# EAGLE design PDIP-Potentiostat-14 (EAGLE 6.4)
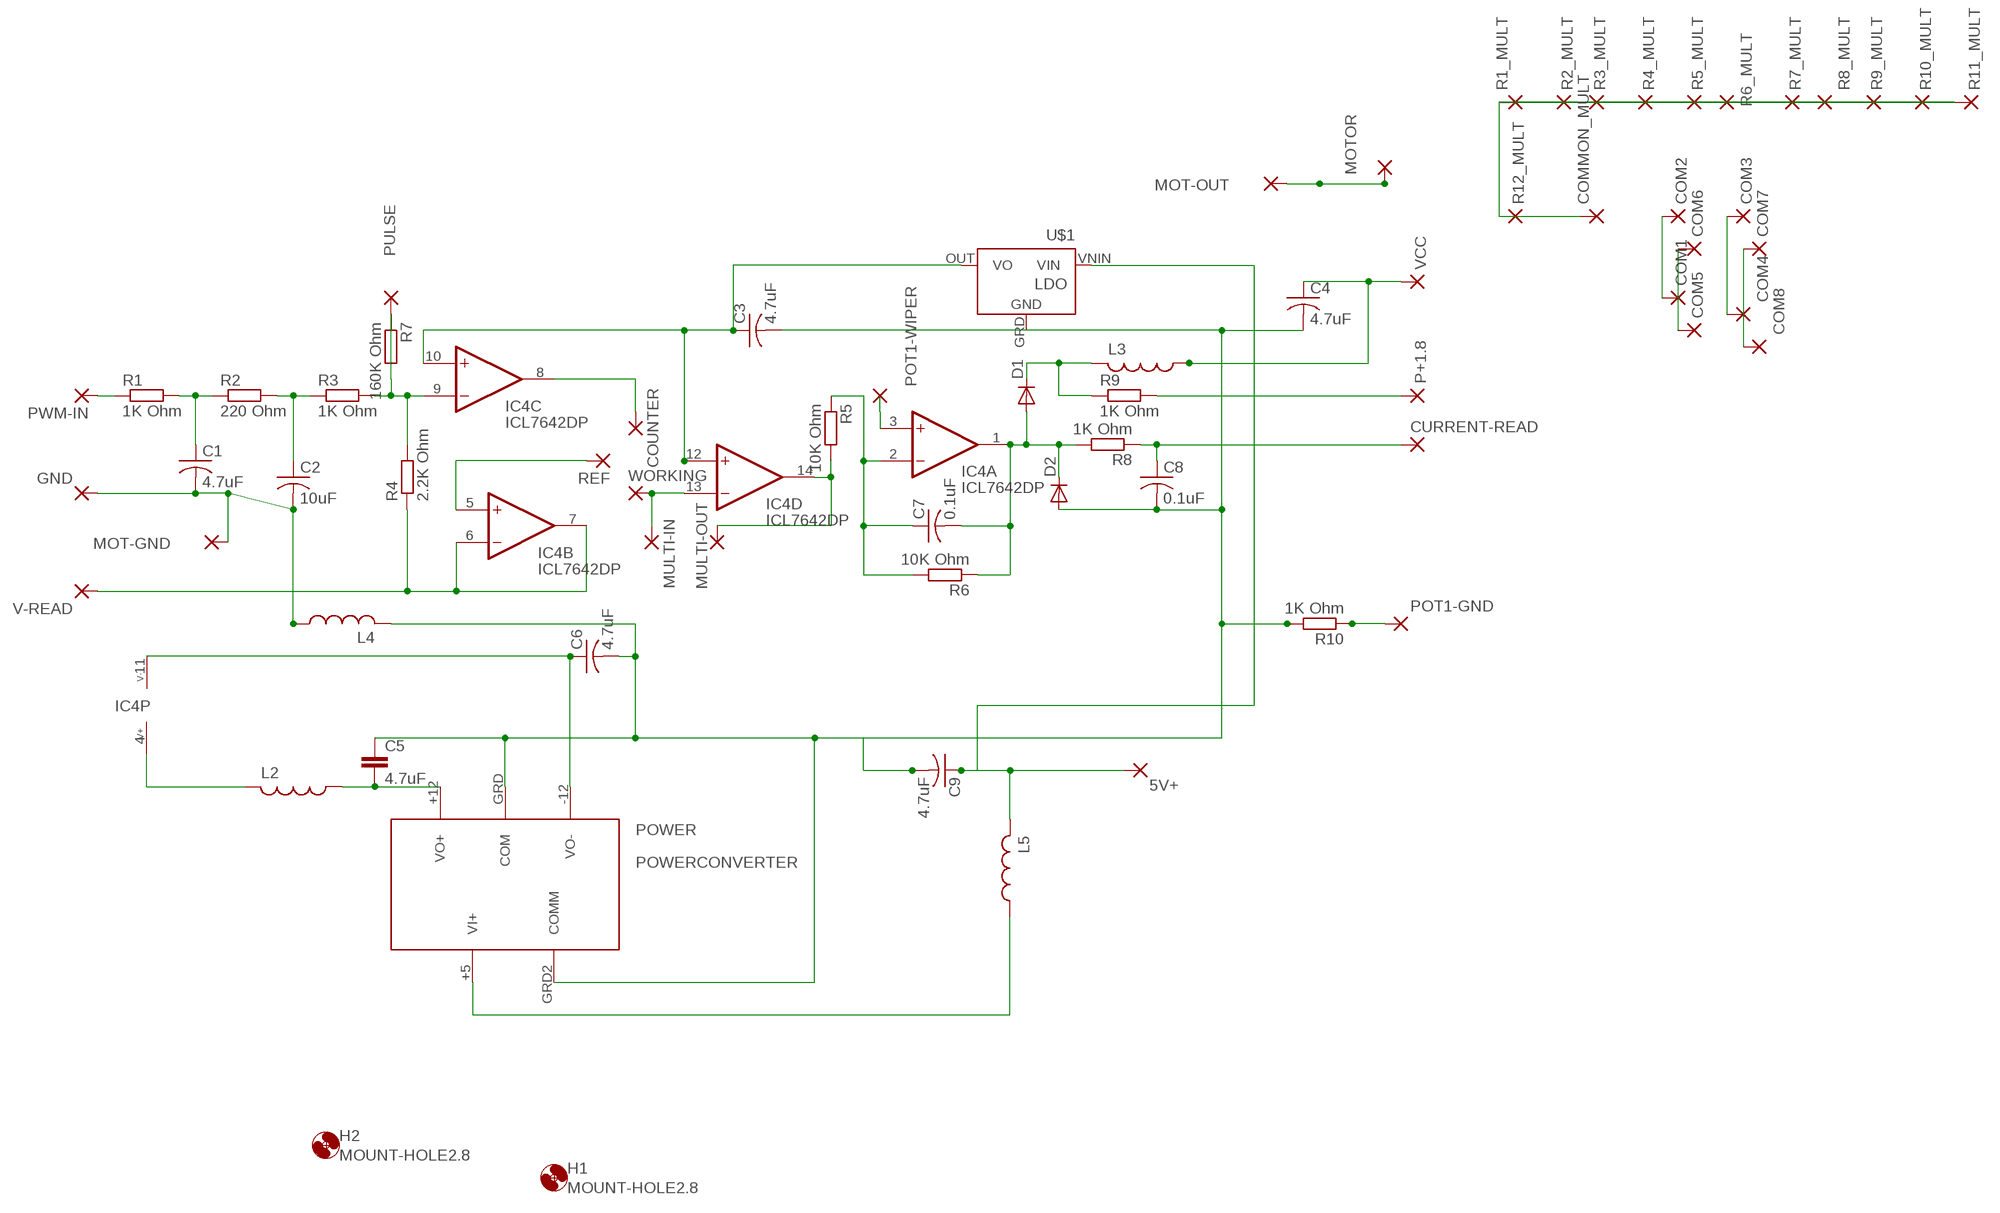
[diagram p0: schematic, sheet 1]

## Parts
5V+  1,6/0,9  [1,6/0,9]
C1  4.7uF  C-US025-050X050  [C025-050X050]
C2  10uF  C-US025-050X050  [C025-050X050]
C3  4.7uF  C-US025-050X050  [C025-050X050]
C4  4.7uF  C-US025-050X050  [C025-050X050]
C5  4.7uF  C-EU025-050X050  [C025-050X050]
C6  4.7uF  C-US025-050X050  [C025-050X050]
C7  0.1uF  C-US025-050X050  [C025-050X050]
C8  0.1uF  C-US025-050X050  [C025-050X050]
C9  4.7uF  C-US025-050X050  [C025-050X050]
COM1  1,6/0,9  [1,6/0,9]
COM2  1,6/0,9  [1,6/0,9]
COM3  1,6/0,9  [1,6/0,9]
COM4  1,6/0,9  [1,6/0,9]
COM5  1,6/0,9  [1,6/0,9]
COM6  1,6/0,9  [1,6/0,9]
COM7  1,6/0,9  [1,6/0,9]
COM8  1,6/0,9  [1,6/0,9]
COMMON_MULT  1,6/0,9  [1,6/0,9]
COUNTER  1,6/0,9  [1,6/0,9]
CURRENT-READ  1,6/0,9  [1,6/0,9]
D1  DIODE-D-7.5  [D-7.5]
D2  DIODE-D-7.5  [D-7.5]
GND  1,6/0,9  [1,6/0,9]
H1  MOUNT-HOLE2.8  [2,8]
H2  MOUNT-HOLE2.8  [2,8]
IC4  ICL7642DP  [DIL14]
L2  L-USTFI0305  [TFI0305]
L3  L-USTFI0305  [TFI0305]
L4  L-USTFI0305  [TFI0305]
L5  L-USTFI0305  [TFI0305]
MOT-GND  1,6/0,9  [1,6/0,9]
MOT-OUT  1,6/0,9  [1,6/0,9]
MOTOR  1,6/0,9  [1,6/0,9]
MULTI-IN  1,6/0,9  [1,6/0,9]
MULTI-OUT  1,6/0,9  [1,6/0,9]
P+1.8  1,6/0,9  [1,6/0,9]
POT1-GND  1,6/0,9  [1,6/0,9]
POT1-WIPER  1,6/0,9  [1,6/0,9]
POWER  POWERCONVERTER  [HMM2]
PULSE  1,6/0,9  [1,6/0,9]
PWM-IN  1,6/0,9  [1,6/0,9]
R1  1K Ohm  R-EU_0204/7  [0204/7]
R1_MULT  1,6/0,9  [1,6/0,9]
R2  220 Ohm  R-EU_0204/7  [0204/7]
R2_MULT  1,6/0,9  [1,6/0,9]
R3  1K Ohm  R-EU_0204/7  [0204/7]
R3_MULT  1,6/0,9  [1,6/0,9]
R4  2.2K Ohm  R-EU_0204/7  [0204/7]
R4_MULT  1,6/0,9  [1,6/0,9]
R5  10K Ohm  R-EU_0204/7  [0204/7]
R5_MULT  1,6/0,9  [1,6/0,9]
R6  10K Ohm  R-EU_0204/7  [0204/7]
R6_MULT  1,6/0,9  [1,6/0,9]
R7  160K Ohm  R-EU_0204/7  [0204/7]
R7_MULT  1,6/0,9  [1,6/0,9]
R8  1K Ohm  R-EU_0204/7  [0204/7]
R8_MULT  1,6/0,9  [1,6/0,9]
R9  1K Ohm  R-EU_0204/7  [0204/7]
R9_MULT  1,6/0,9  [1,6/0,9]
R10  1K Ohm  R-EU_0204/7  [0204/7]
R10_MULT  1,6/0,9  [1,6/0,9]
R11_MULT  1,6/0,9  [1,6/0,9]
R12_MULT  1,6/0,9  [1,6/0,9]
REF  1,6/0,9  [1,6/0,9]
U$1  LDO  [LDO]
V-READ  1,6/0,9  [1,6/0,9]
VCC  1,6/0,9  [1,6/0,9]
WORKING  1,6/0,9  [1,6/0,9]

## Nets
+5V: D1.C L3.2 R9.1
N$1: L5.1 POWER.+5(VI+)
N$2: IC4.6(B:-IN) IC4.7(B:OUT) R4.1 V-READ.1(P)
N$3: IC4.5(B:+IN) REF.1(P)
N$4: 5V+.1(P) C9.1 L5.2 U$1.VNIN(VIN)
N$5: COUNTER.1(P) IC4.8(C:OUT)
N$6: IC4.14(D:OUT) MULTI-OUT.1(P) R5.2
N$7: C7.1 IC4.2(A:-IN) R5.1 R6.2
N$8: IC4.4(P:V+) L2.2
N$9: PWM-IN.1(P) R1.1
N$10: IC4.9(C:-IN) R3.2 R4.2 R7.2
N$11: C3.2 C4.2 C5.1 C6.2 C8.2 C9.2 D2.A L4.2 POWER.GRD2(COMM) POWER.GRD(COM) R10.2 U$1.GRD(GND)
N$12: PULSE.1(P) R7.1
N$13: C1.1 R1.2 R2.1
N$14: IC4.3(A:+IN) POT1-WIPER.1(P)
N$15: C1.2 C2.2 GND.1(P) L4.1 MOT-GND.1(P)
N$16: C5.2 L2.1 POWER.+12(VO+)
N$17: IC4.13(D:-IN) MULTI-IN.1(P) WORKING.1(P)
N$18: P+1.8.1(P) R9.2
N$19: C2.1 R2.2 R3.1
N$20: C7.2 D1.A D2.C IC4.1(A:OUT) R6.1 R8.2
N$21: COM3.1(P) COM4.1(P)
N$22: C3.1 IC4.10(C:+IN) IC4.12(D:+IN) U$1.OUT(VO)
N$23: MOT-OUT.1(P) MOTOR.1(P)
N$24: C6.1 IC4.11(P:V-) POWER.-12(VO-)
N$25: C8.1 CURRENT-READ.1(P) R8.1
N$26: C4.1 L3.1 VCC.1(P)
N$27: POT1-GND.1(P) R10.1
N$29: COM1.1(P) COM2.1(P)
N$30: COM7.1(P) COM8.1(P)
N$31: COM5.1(P) COM6.1(P)
N$32: COMMON_MULT.1(P) R1_MULT.1(P) R2_MULT.1(P) R3_MULT.1(P) R4_MULT.1(P) R5_MULT.1(P) R6_MULT.1(P) R7_MULT.1(P) R8_MULT.1(P) R9_MULT.1(P) R10_MULT.1(P) R11_MULT.1(P) R12_MULT.1(P)

## Library data of the parts
5V+ COM1-COM8 COMMON_MULT COUNTER CURRENT-READ GND MOT-GND MOT-OUT MOTOR MULTI-IN MULTI-OUT P+1.8 POT1-GND POT1-WIPER PULSE PWM-IN R1_MULT R2_MULT R3_MULT R4_MULT R5_MULT R6_MULT R7_MULT R8_MULT R9_MULT R10_MULT R11_MULT R12_MULT REF V-READ VCC WORKING = wirepad:1,6/0,9: THROUGH-HOLE PAD
C1-C4 C6-C9 = rcl:C-US: CAPACITOR, American symbol
C5 = resistor:C-EU: CAPACITOR, European symbol
D1 D2 = diode:DIODE-: DIODE
H1 H2 = holes:MOUNT-HOLE: MOUNTING HOLE with drill center marker
IC4 = maxim:ICL764*: Quad Operational Amplifiers Source: http://datasheets.maxim-ic.com/en/ds/ICL7612-ICL764X.pdf; OC_FARNELL: unknown; OC_NEWARK: unknown
L2-L5 = rcl:L-US: INDUCTOR, American symbol
POWER = Ben:POWERCONVERTER
R1-R10 = rcl:R-EU_: RESISTOR, European symbol
U$1 = Ben:LDO

## Board
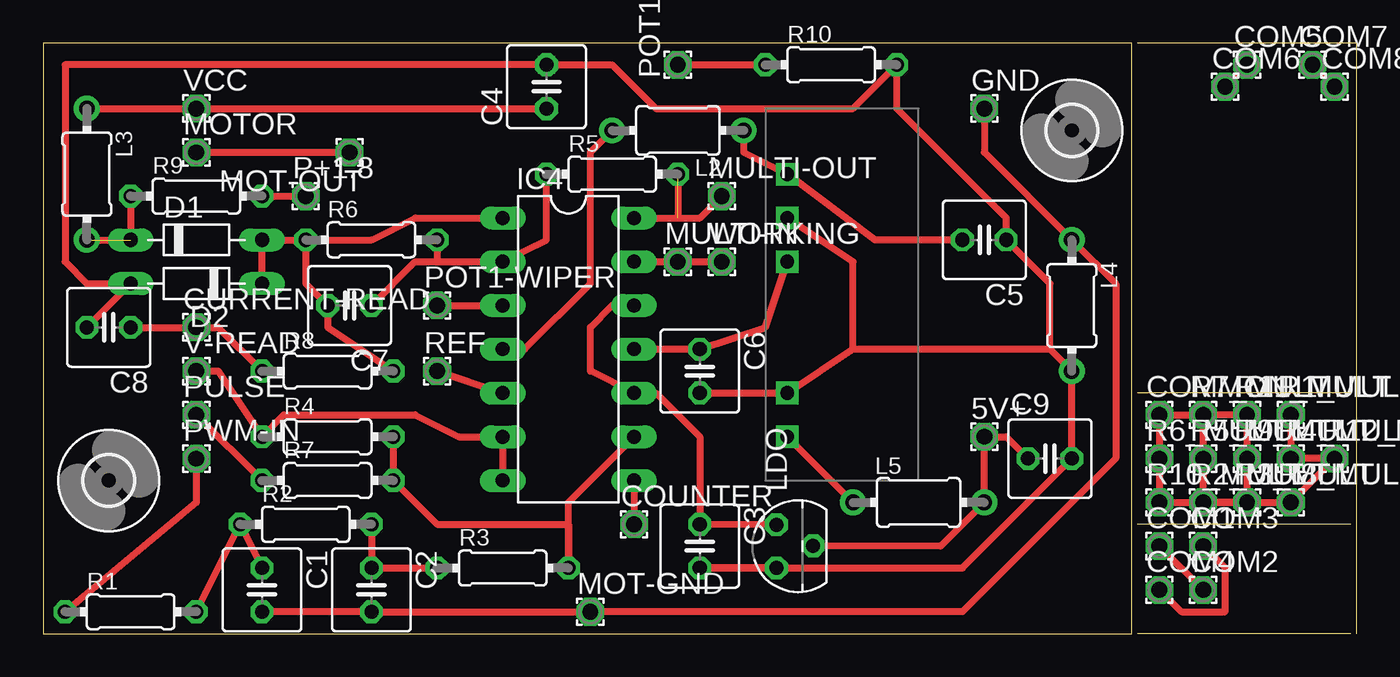
[diagram p1: board, top side]

Size 76.2 x 34.29 mm. Coordinates in mm from the lower left corner, seen from the top.
Outline: 75.87,0 63.5,0
Outline: 76.2,0.01 76.2,34.29 63.5,34.29
Outline: 75.87,6.35 63.5,6.35
Outline: 75.87,13.97 63.5,13.97
Outline: 0,0.01 63.17,0.01 63.17,34.29 0,34.29 0,0.01
Copper layers (1*16): Top 0.035mm / dielectric 1.5mm / Bottom 0.035mm
Design rules "default *": minimum track width 30mil, minimum drill 24mil, track to track 8mil, track to pad 8mil, pad to pad 8mil, via to via 8mil, smd to smd 8mil, copper to edge 40mil, drill to drill 8mil, minimum pad ring 10mil, minimum via ring 8mil, stop-mask expansion 4mil, vias tented up to drill 0mil, thermal gap 10mil

### Footprints (pad centres in the part's own frame; a part is rotated, then mirrored left to right if it is on the bottom)
1,6/0,9 = drill 0.914 pad 1.6 octagon: 1 0,0
C025-050X050 = drill 0.813 octagon: 1 -1.27,0; 2 1.27,0
D-7.5 = drill 0.813 long: A 3.81,0; C -3.81,0
2,8 = hole 2.8: 0,0
DIL14 = drill 0.813 long: 1 -7.62,-3.81; 2 -5.08,-3.81; 3 -2.54,-3.81; 4 0,-3.81; 5 2.54,-3.81; 6 5.08,-3.81; 7 7.62,-3.81; 8 7.62,3.81; 9 5.08,3.81; 10 2.54,3.81; 11 0,3.81; 12 -2.54,3.81; 13 -5.08,3.81; 14 -7.62,3.81
TFI0305 = drill 0.9 pad 1.5: 1 -3.81,0; 2 3.81,0
HMM2 = drill 0.8 square: +5 -7.62,3.81; +12 7.62,3.81; -12 2.54,3.81; GRD -5.08,3.81; GRD2 5.08,3.81
0204/7 = drill 0.813 octagon: 1 -3.81,0; 2 3.81,0
LDO = drill 0.813 octagon: GRD -1.27,0.635; OUT 1.245,0.635; VNIN 0.025,-1.499

### Placement (x,y rotation side)
5V+  54.61,11.44 0 top
C1  12.7,2.55 270 top
C2  19.05,2.55 270 top
C3  38.1,5.09 270 top
C4  29.21,31.76 90 top
C5  54.61,22.87 180 top
C6  38.1,15.25 270 top
C7  17.78,19.06 180 top
C8  3.81,17.79 180 top
C9  58.42,10.17 0 top
COM1  64.77,5.09 0 top
COM2  67.31,2.55 0 top
COM3  67.31,5.09 0 top
COM4  64.77,2.55 0 top
COM5  69.85,33.03 0 top
COM6  68.58,31.76 0 top
COM7  73.66,33.03 0 top
COM8  74.93,31.76 0 top
COMMON_MULT  64.77,12.71 0 top
COUNTER  34.29,6.36 0 top
CURRENT-READ  8.89,17.79 0 top
D1  8.89,22.87 0 top
D2  8.89,20.33 180 top
GND  54.61,30.49 0 top
H1  3.81,8.9 0 top
H2  59.69,29.22 0 top
IC4  30.48,16.52 270 top
L2  36.83,29.22 180 top
L3  2.54,26.68 270 top
L4  59.69,19.06 270 top
L5  50.8,7.63 0 top
MOT-GND  31.75,1.28 0 top
MOT-OUT  17.78,27.95 180 top
MOTOR  8.89,27.95 0 top
MULTI-IN  36.83,21.6 0 top
MULTI-OUT  39.37,25.41 0 top
P+1.8  15.24,25.41 0 top
POT1-GND  36.83,33.03 90 top
POT1-WIPER  22.86,19.06 0 top
POWER  46.99,19.06 90 top
PULSE  8.89,12.71 0 top
PWM-IN  8.89,10.17 0 top
R1  5.08,1.28 0 top
R1_MULT  72.39,12.71 0 top
R2  15.24,6.36 0 top
R2_MULT  67.31,7.63 0 top
R3  26.67,3.82 0 top
R3_MULT  69.85,7.63 0 top
R4  16.51,11.44 0 top
R4_MULT  72.39,10.17 0 top
R5  33.02,26.68 0 top
R5_MULT  67.31,10.17 0 top
R6  19.05,22.87 0 top
R6_MULT  64.77,10.17 0 top
R7  16.51,8.9 0 top
R7_MULT  67.31,12.71 0 top
R8  16.51,15.25 0 top
R8_MULT  72.39,7.63 0 top
R9  8.89,25.41 0 top
R9_MULT  69.85,10.17 0 top
R10  45.72,33.03 0 top
R10_MULT  64.77,7.63 0 top
R11_MULT  69.85,12.71 0 top
R12_MULT  74.93,10.17 0 top
REF  22.86,15.25 0 top
U$1  43.18,5.09 90 top
V-READ  8.89,15.25 0 top
VCC  8.89,30.49 0 top
WORKING  39.37,21.6 0 top

### Tracks (layer width: path | path; a pad name or v marks a point on that pad's centre or on a via)
+5V  (1 unrouted)
  Top 0.406: R9.1 D1.C L3.2
N$1
  Top 0.406: POWER.+5 L5.1
N$2
  Top 0.406: IC4.7 IC4.6 24.13,11.44 21.59,12.71 13.97,12.71 R4.1 10.16,15.25 V-READ.1
N$3
  Top 0.406: REF.1 IC4.5
N$4
  Top 0.406: C9.1 55.88,11.44 5V+.1 L5.2 52.07,5.09 U$1.VNIN
N$5
  Top 0.406: IC4.8 COUNTER.1
N$6  (1 unrouted)
  Top 0.406: IC4.14 36.83,24.14 | 36.83,24.14 38.1,24.14 MULTI-OUT.1 | R5.2 36.83,24.14
N$7
  Top 0.406: R5.1 29.21,22.87 IC4.2 22.86,21.6 | C7.1 21.59,21.6 22.86,21.6 | R6.2 22.86,21.6
N$8
  Top 0.406: IC4.4 27.94,16.52 31.75,20.33 31.75,27.95 L2.2
N$9
  Top 0.406: PWM-IN.1 8.89,7.63 R1.1
N$10
  Top 0.406: R4.2 R7.2 22.86,6.36 30.48,6.36 R3.2 30.48,7.63 IC4.9
N$11  (via drill 0.6)
  Top 0.406: C8.2 D2.A 2.54,20.33 1.27,21.6 1.27,33.03 C4.2 33.02,33.03 35.56,30.49 46.99,30.49 R10.2 49.53,30.49 55.88,24.14 C5.1 58.42,20.33 58.42,16.52 | 46.99,16.52 POWER.GRD C6.2 | 46.99,16.52 46.99,21.6 POWER.GRD2 | 46.99,16.52 58.42,16.52 | 58.42,16.52 L4.2 C9.2 53.34,3.82 C3.2 U$1.GRD
  other vias: 29.21,33.03 29.21,33.03
N$12
  Top 0.406: PULSE.1 R7.1
N$13
  Top 0.406: R1.2 R2.1 C1.1
N$14
  Top 0.406: POT1-WIPER.1 IC4.3
N$15
  Top 0.406: C1.2 C2.2 MOT-GND.1 53.34,1.28 62.23,10.17 62.23,20.33 L4.1 54.61,27.95 GND.1
N$16
  Top 0.406: L2.1 40.64,27.95 POWER.+12 48.26,22.87 C5.2
N$17
  Top 0.406: IC4.13 MULTI-IN.1 WORKING.1
N$18
  Top 0.406: R9.2 P+1.8.1
N$19
  Top 0.406: R2.2 C2.1 R3.1
N$20
  Top 0.406: R8.2 16.51,17.79 C7.2 15.24,20.33 R6.1 | R6.1 19.05,22.87 21.59,24.14 IC4.1 | D2.C D1.A R6.1
N$21
  Top 0.406: COM4.1 66.04,1.28 68.58,1.28 68.58,3.82 COM3.1
N$22
  Top 0.406: IC4.12 33.02,19.06 31.75,17.79 31.75,15.25 IC4.10 35.56,13.98 38.1,11.44 C3.1 U$1.OUT
N$23
  Top 0.406: MOTOR.1 MOT-OUT.1
N$24
  Top 0.406: IC4.11 C6.1 41.91,17.79 POWER.-12
N$25
  Top 0.406: C8.1 CURRENT-READ.1 10.16,17.79 R8.1
N$26
  Top 0.406: L3.1 VCC.1 C4.1
N$27
  Top 0.406: POT1-GND.1 R10.1
N$29
  Top 0.406: COM1.1 COM2.1
N$30
  Top 0.406: COM7.1 COM8.1
N$31
  Top 0.406: COM5.1 COM6.1
N$32
  Top 0.406: R1_MULT.1 R4_MULT.1 R12_MULT.1 R8_MULT.1 R10_MULT.1 R6_MULT.1 COMMON_MULT.1 R7_MULT.1 | R7_MULT.1 R5_MULT.1 R2_MULT.1 R3_MULT.1 R9_MULT.1 R11_MULT.1 R7_MULT.1